# EAGLE schematic 4high (EAGLE 6.6.0)
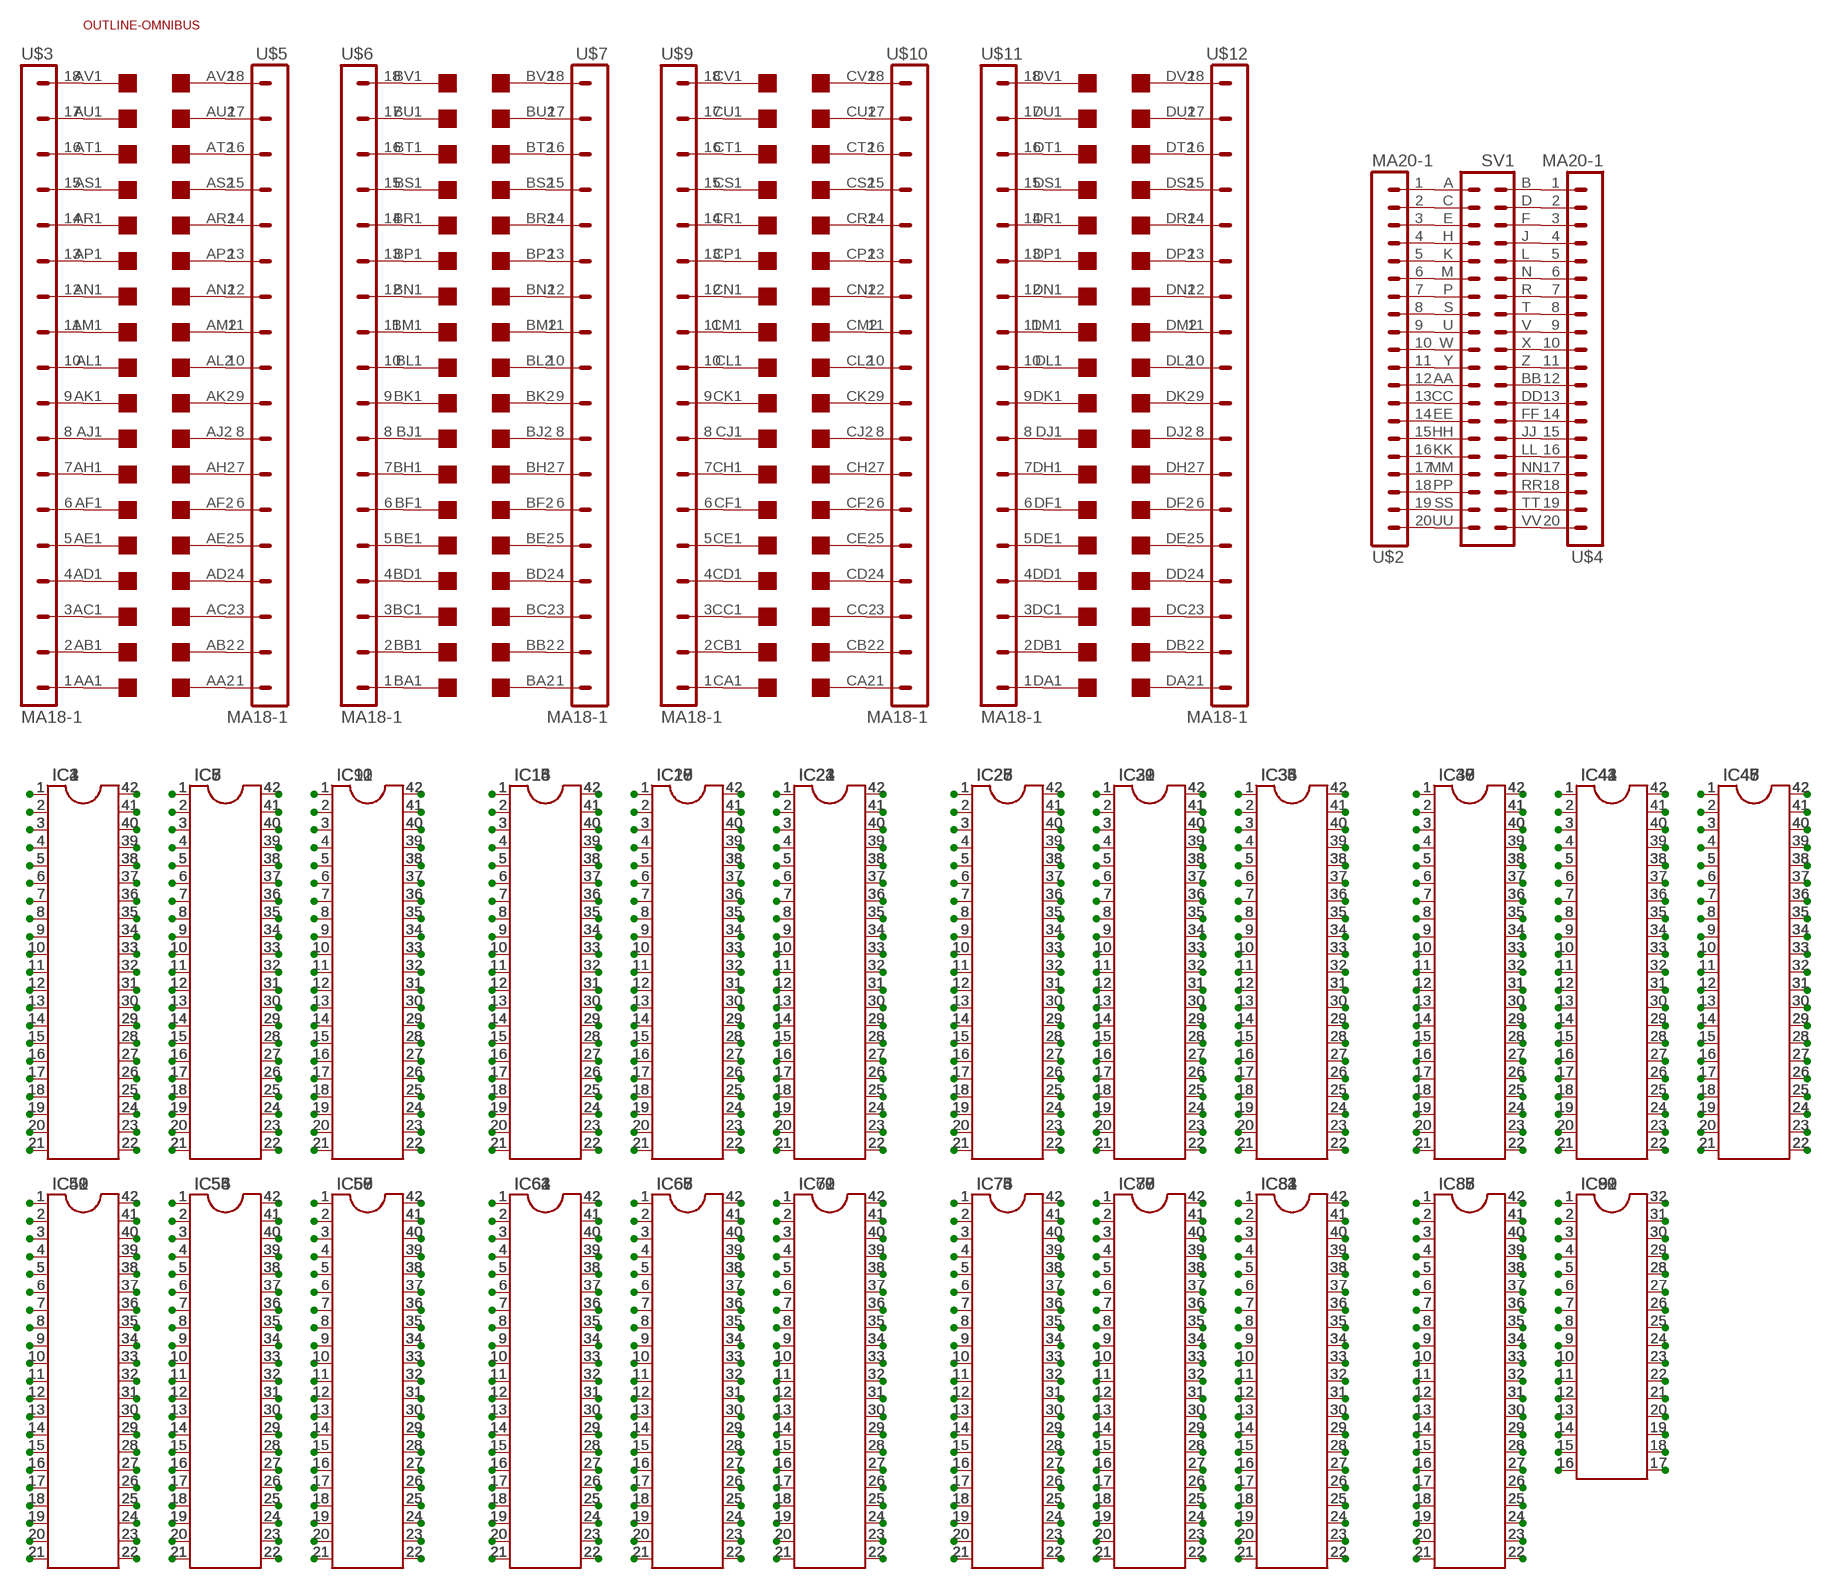
[diagram p0: schematic, sheet 1]

## Parts
IC1  DIL42  [DIL42]
IC2  DIL42  [DIL42]
IC3  DIL42  [DIL42]
IC4  DIL42  [DIL42]
IC5  DIL42  [DIL42]
IC6  DIL42  [DIL42]
IC7  DIL42  [DIL42]
IC8  DIL42  [DIL42]
IC9  DIL42  [DIL42]
IC10  DIL42  [DIL42]
IC11  DIL42  [DIL42]
IC12  DIL42  [DIL42]
IC13  DIL42  [DIL42]
IC14  DIL42  [DIL42]
IC15  DIL42  [DIL42]
IC16  DIL42  [DIL42]
IC17  DIL42  [DIL42]
IC18  DIL42  [DIL42]
IC19  DIL42  [DIL42]
IC20  DIL42  [DIL42]
IC21  DIL42  [DIL42]
IC22  DIL42  [DIL42]
IC23  DIL42  [DIL42]
IC24  DIL42  [DIL42]
IC25  DIL42  [DIL42]
IC26  DIL42  [DIL42]
IC27  DIL42  [DIL42]
IC28  DIL42  [DIL42]
IC29  DIL42  [DIL42]
IC30  DIL42  [DIL42]
IC31  DIL42  [DIL42]
IC32  DIL42  [DIL42]
IC33  DIL42  [DIL42]
IC34  DIL42  [DIL42]
IC35  DIL42  [DIL42]
IC36  DIL42  [DIL42]
IC37  DIL42  [DIL42]
IC38  DIL42  [DIL42]
IC39  DIL42  [DIL42]
IC40  DIL42  [DIL42]
IC41  DIL42  [DIL42]
IC42  DIL42  [DIL42]
IC43  DIL42  [DIL42]
IC44  DIL42  [DIL42]
IC45  DIL42  [DIL42]
IC46  DIL42  [DIL42]
IC47  DIL42  [DIL42]
IC48  DIL42  [DIL42]
IC49  DIL42  [DIL42]
IC50  DIL42  [DIL42]
IC51  DIL42  [DIL42]
IC52  DIL42  [DIL42]
IC53  DIL42  [DIL42]
IC54  DIL42  [DIL42]
IC55  DIL42  [DIL42]
IC56  DIL42  [DIL42]
IC57  DIL42  [DIL42]
IC58  DIL42  [DIL42]
IC59  DIL42  [DIL42]
IC60  DIL42  [DIL42]
IC61  DIL42  [DIL42]
IC62  DIL42  [DIL42]
IC63  DIL42  [DIL42]
IC64  DIL42  [DIL42]
IC65  DIL42  [DIL42]
IC66  DIL42  [DIL42]
IC67  DIL42  [DIL42]
IC68  DIL42  [DIL42]
IC69  DIL42  [DIL42]
IC70  DIL42  [DIL42]
IC71  DIL42  [DIL42]
IC72  DIL42  [DIL42]
IC73  DIL42  [DIL42]
IC74  DIL42  [DIL42]
IC75  DIL42  [DIL42]
IC76  DIL42  [DIL42]
IC77  DIL42  [DIL42]
IC78  DIL42  [DIL42]
IC79  DIL42  [DIL42]
IC80  DIL42  [DIL42]
IC81  DIL42  [DIL42]
IC82  DIL42  [DIL42]
IC83  DIL42  [DIL42]
IC84  DIL42  [DIL42]
IC85  DIL42  [DIL42]
IC86  DIL42  [DIL42]
IC87  DIL42  [DIL42]
IC88  DIL42  [DIL42]
IC89  DIL32  [DIL32]
IC90  DIL32  [DIL32]
IC91  DIL32  [DIL32]
IC92  DIL32  [DIL32]
SV1  DEC40PINH  [DEC40PINH]
U$1  QUAD  [EDGE-CON8]
U$2  MA20-1  [MA20-1]
U$3  MA18-1  [MA18-1]
U$4  MA20-1  [MA20-1]
U$5  MA18-1  [MA18-1]
U$6  MA18-1  [MA18-1]
U$7  MA18-1  [MA18-1]
U$8  OUTLINE-OMNIBUS  [OMNIBUS]
U$9  MA18-1  [MA18-1]
U$10  MA18-1  [MA18-1]
U$11  MA18-1  [MA18-1]
U$12  MA18-1  [MA18-1]

## Nets
GND [supply]: U$1.AC2 U$5.3
N$1: IC1.1 IC2.1 IC3.1 IC4.1
N$2: IC1.2 IC2.2 IC3.2 IC4.2
N$3: IC1.3 IC2.3 IC3.3 IC4.3
N$4: IC1.4 IC2.4 IC3.4 IC4.4
N$5: IC1.5 IC2.5 IC3.5 IC4.5
N$6: IC1.6 IC2.6 IC3.6 IC4.6
N$7: IC1.7 IC2.7 IC3.7 IC4.7
N$8: IC1.8 IC2.8 IC3.8 IC4.8
N$9: IC1.9 IC2.9 IC3.9 IC4.9
N$10: IC1.10 IC2.10 IC3.10 IC4.10
N$11: IC1.11 IC2.11 IC3.11 IC4.11
N$12: IC1.12 IC2.12 IC3.12 IC4.12
N$13: IC1.13 IC2.13 IC3.13 IC4.13
N$14: IC1.14 IC2.14 IC3.14 IC4.14
N$15: IC1.15 IC2.15 IC3.15 IC4.15
N$16: IC1.16 IC2.16 IC3.16 IC4.16
N$17: IC1.17 IC2.17 IC3.17 IC4.17
N$18: IC1.18 IC2.18 IC3.18 IC4.18
N$19: IC1.19 IC2.19 IC3.19 IC4.19
N$20: IC1.20 IC2.20 IC3.20 IC4.20
N$21: IC1.21 IC2.21 IC3.21 IC4.21
N$22: IC1.22 IC2.22 IC3.22 IC4.22
N$23: IC1.23 IC2.23 IC3.23 IC4.23
N$24: IC1.24 IC2.24 IC3.24 IC4.24
N$25: IC1.25 IC2.25 IC3.25 IC4.25
N$26: IC1.26 IC2.26 IC3.26 IC4.26
N$27: IC1.27 IC2.27 IC3.27 IC4.27
N$28: IC1.28 IC2.28 IC3.28 IC4.28
N$29: IC1.29 IC2.29 IC3.29 IC4.29
N$30: IC1.30 IC2.30 IC3.30 IC4.30
N$31: IC1.31 IC2.31 IC3.31 IC4.31
N$32: IC1.32 IC2.32 IC3.32 IC4.32
N$33: IC1.33 IC2.33 IC3.33 IC4.33
N$34: IC1.34 IC2.34 IC3.34 IC4.34
N$35: IC1.35 IC2.35 IC3.35 IC4.35
N$36: IC1.36 IC2.36 IC3.36 IC4.36
N$37: IC1.37 IC2.37 IC3.37 IC4.37
N$38: IC1.38 IC2.38 IC3.38 IC4.38
N$39: IC1.39 IC2.39 IC3.39 IC4.39
N$40: IC1.40 IC2.40 IC3.40 IC4.40
N$41: IC1.41 IC2.41 IC3.41 IC4.41
N$42: IC1.42 IC2.42 IC3.42 IC4.42
N$43: IC5.1 IC6.1 IC7.1 IC8.1
N$44: IC5.2 IC6.2 IC7.2 IC8.2
N$45: IC5.3 IC6.3 IC7.3 IC8.3
N$46: IC5.4 IC6.4 IC7.4 IC8.4
N$47: IC5.5 IC6.5 IC7.5 IC8.5
N$48: IC5.6 IC6.6 IC7.6 IC8.6
N$49: IC5.7 IC6.7 IC7.7 IC8.7
N$50: IC5.8 IC6.8 IC7.8 IC8.8
N$51: IC5.9 IC6.9 IC7.9 IC8.9
N$52: IC5.10 IC6.10 IC7.10 IC8.10
N$53: IC5.11 IC6.11 IC7.11 IC8.11
N$54: IC5.12 IC6.12 IC7.12 IC8.12
N$55: IC5.13 IC6.13 IC7.13 IC8.13
N$56: IC5.14 IC6.14 IC7.14 IC8.14
N$57: IC5.15 IC6.15 IC7.15 IC8.15
N$58: IC5.16 IC6.16 IC7.16 IC8.16
N$59: IC5.17 IC6.17 IC7.17 IC8.17
N$60: IC5.18 IC6.18 IC7.18 IC8.18
N$61: IC5.19 IC6.19 IC7.19 IC8.19
N$62: IC5.20 IC6.20 IC7.20 IC8.20
N$63: IC5.21 IC6.21 IC7.21 IC8.21
N$64: IC5.22 IC6.22 IC7.22 IC8.22
N$65: IC5.23 IC6.23 IC7.23 IC8.23
N$66: IC5.24 IC6.24 IC7.24 IC8.24
N$67: IC5.25 IC6.25 IC7.25 IC8.25
N$68: IC5.26 IC6.26 IC7.26 IC8.26
N$69: IC5.27 IC6.27 IC7.27 IC8.27
N$70: IC5.28 IC6.28 IC7.28 IC8.28
N$71: IC5.29 IC6.29 IC7.29 IC8.29
N$72: IC5.30 IC6.30 IC7.30 IC8.30
N$73: IC5.31 IC6.31 IC7.31 IC8.31
N$74: IC5.32 IC6.32 IC7.32 IC8.32
N$75: IC5.33 IC6.33 IC7.33 IC8.33
N$76: IC5.34 IC6.34 IC7.34 IC8.34
N$77: IC5.35 IC6.35 IC7.35 IC8.35
N$78: IC5.36 IC6.36 IC7.36 IC8.36
N$79: IC5.37 IC6.37 IC7.37 IC8.37
N$80: IC5.38 IC6.38 IC7.38 IC8.38
N$81: IC5.39 IC6.39 IC7.39 IC8.39
N$82: IC5.40 IC6.40 IC7.40 IC8.40
N$83: IC5.41 IC6.41 IC7.41 IC8.41
N$84: IC5.42 IC6.42 IC7.42 IC8.42
N$85: IC9.1 IC10.1 IC11.1 IC12.1
N$86: IC9.2 IC10.2 IC11.2 IC12.2
N$87: IC9.3 IC10.3 IC11.3 IC12.3
N$88: IC9.4 IC10.4 IC11.4 IC12.4
N$89: IC9.5 IC10.5 IC11.5 IC12.5
N$90: IC9.6 IC10.6 IC11.6 IC12.6
N$91: IC9.7 IC10.7 IC11.7 IC12.7
N$92: IC9.8 IC10.8 IC11.8 IC12.8
N$93: IC9.9 IC10.9 IC11.9 IC12.9
N$94: IC9.10 IC10.10 IC11.10 IC12.10
N$95: IC9.11 IC10.11 IC11.11 IC12.11
N$96: IC9.12 IC10.12 IC11.12 IC12.12
N$97: IC9.13 IC10.13 IC11.13 IC12.13
N$98: IC9.14 IC10.14 IC11.14 IC12.14
N$99: IC9.15 IC10.15 IC11.15 IC12.15
N$100: IC9.16 IC10.16 IC11.16 IC12.16
N$101: IC9.17 IC10.17 IC11.17 IC12.17
N$102: IC9.18 IC10.18 IC11.18 IC12.18
N$103: IC9.19 IC10.19 IC11.19 IC12.19
N$104: IC9.20 IC10.20 IC11.20 IC12.20
N$105: IC9.21 IC10.21 IC11.21 IC12.21
N$106: IC9.22 IC10.22 IC11.22 IC12.22
N$107: IC9.23 IC10.23 IC11.23 IC12.23
N$108: IC9.24 IC10.24 IC11.24 IC12.24
N$109: IC9.25 IC10.25 IC11.25 IC12.25
N$110: IC9.26 IC10.26 IC11.26 IC12.26
N$111: IC9.27 IC10.27 IC11.27 IC12.27
N$112: IC9.28 IC10.28 IC11.28 IC12.28
N$113: IC9.29 IC10.29 IC11.29 IC12.29
N$114: IC9.30 IC10.30 IC11.30 IC12.30
N$115: IC9.31 IC10.31 IC11.31 IC12.31
N$116: IC9.32 IC10.32 IC11.32 IC12.32
N$117: IC9.33 IC10.33 IC11.33 IC12.33
N$118: IC9.34 IC10.34 IC11.34 IC12.34
N$119: IC9.35 IC10.35 IC11.35 IC12.35
N$120: IC9.36 IC10.36 IC11.36 IC12.36
N$121: IC9.37 IC10.37 IC11.37 IC12.37
N$122: IC9.38 IC10.38 IC11.38 IC12.38
N$123: IC9.39 IC10.39 IC11.39 IC12.39
N$124: IC9.40 IC10.40 IC11.40 IC12.40
N$125: IC9.41 IC10.41 IC11.41 IC12.41
N$126: IC9.42 IC10.42 IC11.42 IC12.42
N$127: IC13.1 IC14.1 IC15.1 IC16.1
N$128: IC13.2 IC14.2 IC15.2 IC16.2
N$129: IC13.3 IC14.3 IC15.3 IC16.3
N$130: IC13.4 IC14.4 IC15.4 IC16.4
N$131: IC13.5 IC14.5 IC15.5 IC16.5
N$132: IC13.6 IC14.6 IC15.6 IC16.6
N$133: IC13.7 IC14.7 IC15.7 IC16.7
N$134: IC13.8 IC14.8 IC15.8 IC16.8
N$135: IC13.9 IC14.9 IC15.9 IC16.9
N$136: IC13.10 IC14.10 IC15.10 IC16.10
N$137: IC13.11 IC14.11 IC15.11 IC16.11
N$138: IC13.12 IC14.12 IC15.12 IC16.12
N$139: IC13.13 IC14.13 IC15.13 IC16.13
N$140: IC13.14 IC14.14 IC15.14 IC16.14
N$141: IC13.15 IC14.15 IC15.15 IC16.15
N$142: IC13.16 IC14.16 IC15.16 IC16.16
N$143: IC13.17 IC14.17 IC15.17 IC16.17
N$144: IC13.18 IC14.18 IC15.18 IC16.18
N$145: IC13.19 IC14.19 IC15.19 IC16.19
N$146: IC13.20 IC14.20 IC15.20 IC16.20
N$147: IC13.21 IC14.21 IC15.21 IC16.21
N$148: IC13.22 IC14.22 IC15.22 IC16.22
N$149: IC13.23 IC14.23 IC15.23 IC16.23
N$150: IC13.24 IC14.24 IC15.24 IC16.24
N$151: IC13.25 IC14.25 IC15.25 IC16.25
N$152: IC13.26 IC14.26 IC15.26 IC16.26
N$153: IC13.27 IC14.27 IC15.27 IC16.27
N$154: IC13.28 IC14.28 IC15.28 IC16.28
N$155: IC13.29 IC14.29 IC15.29 IC16.29
N$156: IC13.30 IC14.30 IC15.30 IC16.30
N$157: IC13.31 IC14.31 IC15.31 IC16.31
N$158: IC13.32 IC14.32 IC15.32 IC16.32
N$159: IC13.33 IC14.33 IC15.33 IC16.33
N$160: IC13.34 IC14.34 IC15.34 IC16.34
N$161: IC13.35 IC14.35 IC15.35 IC16.35
N$162: IC13.36 IC14.36 IC15.36 IC16.36
N$163: IC13.37 IC14.37 IC15.37 IC16.37
N$164: IC13.38 IC14.38 IC15.38 IC16.38
N$165: IC13.39 IC14.39 IC15.39 IC16.39
N$166: IC13.40 IC14.40 IC15.40 IC16.40
N$167: IC13.41 IC14.41 IC15.41 IC16.41
N$168: IC13.42 IC14.42 IC15.42 IC16.42
N$169: U$1.AK1 U$3.9
N$170: U$1.AL1 U$3.10
N$171: U$1.AM1 U$3.11
N$172: U$1.AN1 U$3.12
N$173: U$1.AP1 U$3.13
N$174: U$1.AR1 U$3.14
N$175: U$1.AS1 U$3.15
N$176: U$1.AT1 U$3.16
N$177: U$1.AU1 U$3.17
N$178: U$1.AV1 U$3.18
N$179: U$1.AJ1 U$3.8
N$180: U$1.AH1 U$3.7
N$181: U$1.AF1 U$3.6
N$182: U$1.AE1 U$3.5
N$183: U$1.AD1 U$3.4
N$184: U$1.AC1 U$3.3
N$185: U$1.AB1 U$3.2
N$186: U$1.AA1 U$3.1
N$187: U$1.AL2 U$5.10
N$188: U$1.AM2 U$5.11
N$189: U$1.AN2 U$5.12
N$190: U$1.AP2 U$5.13
N$191: U$1.AR2 U$5.14
N$192: U$1.AS2 U$5.15
N$193: U$1.AT2 U$5.16
N$194: U$1.AK2 U$5.9
N$195: U$1.AJ2 U$5.8
N$196: U$1.AH2 U$5.7
N$197: U$1.AF2 U$5.6
N$198: U$1.AE2 U$5.5
N$199: U$1.AD2 U$5.4
N$200: IC17.1 IC18.1 IC19.1 IC20.1
N$201: U$1.AU2 U$5.17
N$202: U$1.AV2 U$5.18
N$203: U$1.AB2 U$5.2
N$204: IC17.2 IC18.2 IC19.2 IC20.2
N$205: IC17.3 IC18.3 IC19.3 IC20.3
N$206: IC17.4 IC18.4 IC19.4 IC20.4
N$207: IC17.5 IC18.5 IC19.5 IC20.5
N$208: IC17.6 IC18.6 IC19.6 IC20.6
N$209: IC17.7 IC18.7 IC19.7 IC20.7
N$210: IC17.8 IC18.8 IC19.8 IC20.8
N$211: IC17.9 IC18.9 IC19.9 IC20.9
N$212: IC17.10 IC18.10 IC19.10 IC20.10
N$213: IC17.11 IC18.11 IC19.11 IC20.11
N$214: IC17.12 IC18.12 IC19.12 IC20.12
N$215: IC17.13 IC18.13 IC19.13 IC20.13
N$216: IC17.14 IC18.14 IC19.14 IC20.14
N$217: IC17.15 IC18.15 IC19.15 IC20.15
N$218: IC17.16 IC18.16 IC19.16 IC20.16
N$219: IC17.17 IC18.17 IC19.17 IC20.17
N$220: IC17.18 IC18.18 IC19.18 IC20.18
N$221: IC17.19 IC18.19 IC19.19 IC20.19
N$222: IC17.20 IC18.20 IC19.20 IC20.20
N$223: IC17.21 IC18.21 IC19.21 IC20.21
N$224: IC17.22 IC18.22 IC19.22 IC20.22
N$225: IC17.23 IC18.23 IC19.23 IC20.23
N$226: IC17.24 IC18.24 IC19.24 IC20.24
N$227: IC17.25 IC18.25 IC19.25 IC20.25
N$228: IC17.26 IC18.26 IC19.26 IC20.26
N$229: IC17.27 IC18.27 IC19.27 IC20.27
N$230: IC17.28 IC18.28 IC19.28 IC20.28
N$231: IC17.29 IC18.29 IC19.29 IC20.29
N$232: IC17.30 IC18.30 IC19.30 IC20.30
N$233: IC17.31 IC18.31 IC19.31 IC20.31
N$234: IC17.32 IC18.32 IC19.32 IC20.32
N$235: IC17.33 IC18.33 IC19.33 IC20.33
N$236: IC17.34 IC18.34 IC19.34 IC20.34
N$237: IC17.35 IC18.35 IC19.35 IC20.35
N$238: IC17.36 IC18.36 IC19.36 IC20.36
N$239: IC17.37 IC18.37 IC19.37 IC20.37
N$240: IC17.38 IC18.38 IC19.38 IC20.38
N$241: IC17.39 IC18.39 IC19.39 IC20.39
N$242: IC17.40 IC18.40 IC19.40 IC20.40
N$243: IC17.41 IC18.41 IC19.41 IC20.41
N$244: IC17.42 IC18.42 IC19.42 IC20.42
N$245: IC21.1 IC22.1 IC23.1 IC24.1
N$246: IC21.2 IC22.2 IC23.2 IC24.2
N$247: IC21.3 IC22.3 IC23.3 IC24.3
N$248: IC21.4 IC22.4 IC23.4 IC24.4
N$249: IC21.5 IC22.5 IC23.5 IC24.5
N$250: IC21.6 IC22.6 IC23.6 IC24.6
N$251: IC21.7 IC22.7 IC23.7 IC24.7
N$252: IC21.8 IC22.8 IC23.8 IC24.8
N$253: IC21.9 IC22.9 IC23.9 IC24.9
N$254: IC21.10 IC22.10 IC23.10 IC24.10
N$255: IC21.11 IC22.11 IC23.11 IC24.11
N$256: IC21.12 IC22.12 IC23.12 IC24.12
N$257: IC21.13 IC22.13 IC23.13 IC24.13
N$258: IC21.14 IC22.14 IC23.14 IC24.14
N$259: IC21.15 IC22.15 IC23.15 IC24.15
N$260: IC21.16 IC22.16 IC23.16 IC24.16
N$261: IC21.17 IC22.17 IC23.17 IC24.17
N$262: IC21.18 IC22.18 IC23.18 IC24.18
N$263: IC21.19 IC22.19 IC23.19 IC24.19
N$264: IC21.20 IC22.20 IC23.20 IC24.20
N$265: IC21.21 IC22.21 IC23.21 IC24.21
N$266: IC21.22 IC22.22 IC23.22 IC24.22
N$267: IC21.23 IC22.23 IC23.23 IC24.23
N$268: IC21.24 IC22.24 IC23.24 IC24.24
N$269: IC21.25 IC22.25 IC23.25 IC24.25
N$270: IC21.26 IC22.26 IC23.26 IC24.26
N$271: IC21.27 IC22.27 IC23.27 IC24.27
N$272: IC21.28 IC22.28 IC23.28 IC24.28
N$273: IC21.29 IC22.29 IC23.29 IC24.29
N$274: IC21.30 IC22.30 IC23.30 IC24.30
N$275: IC21.31 IC22.31 IC23.31 IC24.31
N$276: IC21.32 IC22.32 IC23.32 IC24.32
N$277: IC21.33 IC22.33 IC23.33 IC24.33
N$278: IC21.34 IC22.34 IC23.34 IC24.34
N$279: IC21.35 IC22.35 IC23.35 IC24.35
N$280: IC21.36 IC22.36 IC23.36 IC24.36
N$281: IC21.37 IC22.37 IC23.37 IC24.37
N$282: IC21.38 IC22.38 IC23.38 IC24.38
N$283: IC21.39 IC22.39 IC23.39 IC24.39
N$284: IC21.40 IC22.40 IC23.40 IC24.40
N$285: IC21.41 IC22.41 IC23.41 IC24.41
N$286: IC21.42 IC22.42 IC23.42 IC24.42
N$287: IC25.1 IC26.1 IC27.1 IC28.1
N$288: IC25.2 IC26.2 IC27.2 IC28.2
N$289: IC25.3 IC26.3 IC27.3 IC28.3
N$290: IC25.4 IC26.4 IC27.4 IC28.4
N$291: IC25.5 IC26.5 IC27.5 IC28.5
N$292: IC25.6 IC26.6 IC27.6 IC28.6
N$293: IC25.7 IC26.7 IC27.7 IC28.7
N$294: IC25.8 IC26.8 IC27.8 IC28.8
N$295: IC25.9 IC26.9 IC27.9 IC28.9
N$296: IC25.10 IC26.10 IC27.10 IC28.10
N$297: IC25.11 IC26.11 IC27.11 IC28.11
N$298: IC25.12 IC26.12 IC27.12 IC28.12
N$299: IC25.13 IC26.13 IC27.13 IC28.13
N$300: IC25.14 IC26.14 IC27.14 IC28.14
N$301: IC25.15 IC26.15 IC27.15 IC28.15
N$302: IC25.16 IC26.16 IC27.16 IC28.16
N$303: IC25.17 IC26.17 IC27.17 IC28.17
N$304: IC25.18 IC26.18 IC27.18 IC28.18
N$305: IC25.19 IC26.19 IC27.19 IC28.19
N$306: IC25.20 IC26.20 IC27.20 IC28.20
N$307: IC25.21 IC26.21 IC27.21 IC28.21
N$308: IC25.22 IC26.22 IC27.22 IC28.22
N$309: IC25.23 IC26.23 IC27.23 IC28.23
N$310: IC25.24 IC26.24 IC27.24 IC28.24
N$311: IC25.25 IC26.25 IC27.25 IC28.25
N$312: IC25.26 IC26.26 IC27.26 IC28.26
N$313: IC25.27 IC26.27 IC27.27 IC28.27
N$314: IC25.28 IC26.28 IC27.28 IC28.28
N$315: IC25.29 IC26.29 IC27.29 IC28.29
N$316: IC25.30 IC26.30 IC27.30 IC28.30
N$317: IC25.31 IC26.31 IC27.31 IC28.31
N$318: IC25.32 IC26.32 IC27.32 IC28.32
N$319: IC25.33 IC26.33 IC27.33 IC28.33
N$320: IC25.34 IC26.34 IC27.34 IC28.34
N$321: IC25.35 IC26.35 IC27.35 IC28.35
N$322: IC25.36 IC26.36 IC27.36 IC28.36
N$323: IC25.37 IC26.37 IC27.37 IC28.37
N$324: IC25.38 IC26.38 IC27.38 IC28.38
N$325: IC25.39 IC26.39 IC27.39 IC28.39
N$326: IC25.40 IC26.40 IC27.40 IC28.40
N$327: IC25.41 IC26.41 IC27.41 IC28.41
N$328: IC25.42 IC26.42 IC27.42 IC28.42
N$329: IC29.1 IC30.1 IC31.1 IC32.1
N$330: IC29.2 IC30.2 IC31.2 IC32.2
N$331: IC29.3 IC30.3 IC31.3 IC32.3
N$332: IC29.4 IC30.4 IC31.4 IC32.4
N$333: IC29.5 IC30.5 IC31.5 IC32.5
N$334: IC29.6 IC30.6 IC31.6 IC32.6
N$335: IC29.7 IC30.7 IC31.7 IC32.7
N$336: IC29.8 IC30.8 IC31.8 IC32.8
N$337: IC29.9 IC30.9 IC31.9 IC32.9
N$338: IC29.10 IC30.10 IC31.10 IC32.10
N$339: IC29.11 IC30.11 IC31.11 IC32.11
N$340: IC29.12 IC30.12 IC31.12 IC32.12
N$341: IC29.13 IC30.13 IC31.13 IC32.13
N$342: IC29.14 IC30.14 IC31.14 IC32.14
N$343: IC29.15 IC30.15 IC31.15 IC32.15
N$344: IC29.16 IC30.16 IC31.16 IC32.16
N$345: IC29.17 IC30.17 IC31.17 IC32.17
N$346: IC29.18 IC30.18 IC31.18 IC32.18
N$347: IC29.19 IC30.19 IC31.19 IC32.19
N$348: IC29.20 IC30.20 IC31.20 IC32.20
N$349: IC29.21 IC30.21 IC31.21 IC32.21
N$350: IC29.22 IC30.22 IC31.22 IC32.22
N$351: IC29.23 IC30.23 IC31.23 IC32.23
N$352: IC29.24 IC30.24 IC31.24 IC32.24
N$353: IC29.25 IC30.25 IC31.25 IC32.25
N$354: IC29.26 IC30.26 IC31.26 IC32.26
N$355: IC29.27 IC30.27 IC31.27 IC32.27
N$356: IC29.28 IC30.28 IC31.28 IC32.28
N$357: IC29.29 IC30.29 IC31.29 IC32.29
N$358: IC29.30 IC30.30 IC31.30 IC32.30
N$359: IC29.31 IC30.31 IC31.31 IC32.31
N$360: IC29.32 IC30.32 IC31.32 IC32.32
N$361: IC29.33 IC30.33 IC31.33 IC32.33
N$362: IC29.34 IC30.34 IC31.34 IC32.34
N$363: IC29.35 IC30.35 IC31.35 IC32.35
N$364: IC29.36 IC30.36 IC31.36 IC32.36
N$365: IC29.37 IC30.37 IC31.37 IC32.37
N$366: IC29.38 IC30.38 IC31.38 IC32.38
N$367: IC29.39 IC30.39 IC31.39 IC32.39
N$368: IC29.40 IC30.40 IC31.40 IC32.40
N$369: IC29.41 IC30.41 IC31.41 IC32.41
N$370: IC29.42 IC30.42 IC31.42 IC32.42
N$371: IC33.1 IC34.1 IC35.1 IC36.1
N$372: IC33.2 IC34.2 IC35.2 IC36.2
N$373: U$1.BV1 U$6.18
N$374: U$1.BU1 U$6.17
N$375: U$1.BT1 U$6.16
N$376: U$1.BS1 U$6.15
N$377: U$1.BR1 U$6.14
N$378: U$1.BP1 U$6.13
N$379: U$1.BN1 U$6.12
N$380: U$1.BM1 U$6.11
N$381: U$1.BL1 U$6.10
N$382: U$1.BK1 U$6.9
N$383: U$1.BJ1 U$6.8
N$384: U$1.BH1 U$6.7
N$385: U$1.BF1 U$6.6
N$386: U$1.BE1 U$6.5
N$387: U$1.BD1 U$6.4
N$388: U$1.BC1 U$6.3
N$389: U$1.BB1 U$6.2
N$390: U$1.BA1 U$6.1
N$391: U$1.BV2 U$7.18
N$392: U$1.BU2 U$7.17
N$393: U$1.BT2 U$7.16
N$394: U$1.BS2 U$7.15
N$395: U$1.BR2 U$7.14
N$396: U$1.BP2 U$7.13
N$397: U$1.BN2 U$7.12
N$398: U$1.BM2 U$7.11
N$399: U$1.BL2 U$7.10
N$400: U$1.BK2 U$7.9
N$401: U$1.BJ2 U$7.8
N$402: U$1.BH2 U$7.7
N$403: U$1.BF2 U$7.6
N$404: U$1.BE2 U$7.5
N$405: U$1.BD2 U$7.4
N$406: U$1.BC2 U$7.3
N$407: U$1.BB2 U$7.2
N$408: U$1.BA2 U$7.1
N$409: U$1.CV1 U$9.18
N$410: U$1.CU1 U$9.17
N$411: U$1.CT1 U$9.16
N$412: U$1.CS1 U$9.15
N$413: U$1.CR1 U$9.14
N$414: U$1.CP1 U$9.13
N$415: U$1.CN1 U$9.12
N$416: U$1.CM1 U$9.11
N$417: U$1.CL1 U$9.10
N$418: U$1.CK1 U$9.9
N$419: U$1.CJ1 U$9.8
N$420: U$1.CH1 U$9.7
N$421: U$1.CF1 U$9.6
N$422: U$1.CE1 U$9.5
N$423: U$1.CD1 U$9.4
N$424: U$1.CC1 U$9.3
N$425: U$1.CB1 U$9.2
N$426: U$1.CA1 U$9.1
N$427: U$1.CV2 U$10.18
N$428: U$1.CU2 U$10.17
N$429: U$1.CT2 U$10.16
N$430: U$1.CS2 U$10.15
N$431: U$1.CR2 U$10.14
N$432: U$1.CP2 U$10.13
N$433: U$1.CN2 U$10.12
N$434: U$1.CM2 U$10.11
N$435: U$1.CL2 U$10.10
N$436: U$1.CK2 U$10.9
N$437: U$1.CJ2 U$10.8
N$438: U$1.CH2 U$10.7
N$439: U$1.CF2 U$10.6
N$440: U$1.CE2 U$10.5
N$441: U$1.CD2 U$10.4
N$442: U$1.CC2 U$10.3
N$443: U$1.CB2 U$10.2
N$444: U$1.CA2 U$10.1
N$445: U$1.DV1 U$11.18
N$446: U$1.DU1 U$11.17
N$447: U$1.DT1 U$11.16
N$448: U$1.DS1 U$11.15
N$449: U$1.DR1 U$11.14
N$450: U$1.DP1 U$11.13
N$451: U$1.DN1 U$11.12
N$452: U$1.DM1 U$11.11
N$453: U$1.DL1 U$11.10
N$454: U$1.DK1 U$11.9
N$455: U$1.DJ1 U$11.8
N$456: U$1.DH1 U$11.7
N$457: U$1.DF1 U$11.6
N$458: U$1.DE1 U$11.5
N$459: U$1.DD1 U$11.4
N$460: U$1.DC1 U$11.3
N$461: U$1.DB1 U$11.2
N$462: U$1.DA1 U$11.1
N$463: U$1.DV2 U$12.18
N$464: U$1.DU2 U$12.17
N$465: U$1.DT2 U$12.16
N$466: U$1.DS2 U$12.15
N$467: U$1.DR2 U$12.14
N$468: U$1.DP2 U$12.13
N$469: U$1.DN2 U$12.12
N$470: U$1.DM2 U$12.11
N$471: U$1.DL2 U$12.10
N$472: U$1.DK2 U$12.9
N$473: U$1.DJ2 U$12.8
N$474: U$1.DH2 U$12.7
N$475: U$1.DF2 U$12.6
N$476: U$1.DE2 U$12.5
N$477: U$1.DD2 U$12.4
N$478: U$1.DC2 U$12.3
N$479: U$1.DB2 U$12.2
N$480: U$1.DA2 U$12.1
N$481: IC33.3 IC34.3 IC35.3 IC36.3
N$482: IC33.4 IC34.4 IC35.4 IC36.4
N$483: IC33.5 IC34.5 IC35.5 IC36.5
N$484: IC33.6 IC34.6 IC35.6 IC36.6
N$485: IC33.7 IC34.7 IC35.7 IC36.7
N$486: IC33.8 IC34.8 IC35.8 IC36.8
N$487: IC33.9 IC34.9 IC35.9 IC36.9
N$488: IC33.10 IC34.10 IC35.10 IC36.10
N$489: IC33.11 IC34.11 IC35.11 IC36.11
N$490: IC33.12 IC34.12 IC35.12 IC36.12
N$491: IC33.13 IC34.13 IC35.13 IC36.13
N$492: IC33.14 IC34.14 IC35.14 IC36.14
N$493: IC33.15 IC34.15 IC35.15 IC36.15
N$494: IC33.16 IC34.16 IC35.16 IC36.16
N$495: IC33.17 IC34.17 IC35.17 IC36.17
N$496: IC33.18 IC34.18 IC35.18 IC36.18
N$497: IC33.19 IC34.19 IC35.19 IC36.19
N$498: IC33.20 IC34.20 IC35.20 IC36.20
N$499: IC33.21 IC34.21 IC35.21 IC36.21
N$500: IC33.22 IC34.22 IC35.22 IC36.22
N$501: IC33.23 IC34.23 IC35.23 IC36.23
N$502: IC33.24 IC34.24 IC35.24 IC36.24
N$503: IC33.25 IC34.25 IC35.25 IC36.25
N$504: IC33.26 IC34.26 IC35.26 IC36.26
N$505: IC33.27 IC34.27 IC35.27 IC36.27
N$506: IC33.28 IC34.28 IC35.28 IC36.28
N$507: IC33.29 IC34.29 IC35.29 IC36.29
N$508: IC33.30 IC34.30 IC35.30 IC36.30
N$509: IC33.31 IC34.31 IC35.31 IC36.31
N$510: IC33.32 IC34.32 IC35.32 IC36.32
N$511: IC33.33 IC34.33 IC35.33 IC36.33
N$512: IC33.34 IC34.34 IC35.34 IC36.34
N$513: IC33.35 IC34.35 IC35.35 IC36.35
N$514: IC33.36 IC34.36 IC35.36 IC36.36
N$515: IC33.37 IC34.37 IC35.37 IC36.37
N$516: IC33.38 IC34.38 IC35.38 IC36.38
N$517: IC33.39 IC34.39 IC35.39 IC36.39
N$518: IC33.40 IC34.40 IC35.40 IC36.40
N$519: IC33.41 IC34.41 IC35.41 IC36.41
N$520: IC33.42 IC34.42 IC35.42 IC36.42
N$521: IC37.1 IC38.1 IC39.1 IC40.1
N$522: IC37.2 IC38.2 IC39.2 IC40.2
N$523: IC37.3 IC38.3 IC39.3 IC40.3
N$524: IC37.4 IC38.4 IC39.4 IC40.4
N$525: IC37.5 IC38.5 IC39.5 IC40.5
N$526: IC37.6 IC38.6 IC39.6 IC40.6
N$527: IC37.7 IC38.7 IC39.7 IC40.7
N$528: IC37.8 IC38.8 IC39.8 IC40.8
N$529: IC37.9 IC38.9 IC39.9 IC40.9
N$530: IC37.10 IC38.10 IC39.10 IC40.10
N$531: IC37.11 IC38.11 IC39.11 IC40.11
N$532: IC37.12 IC38.12 IC39.12 IC40.12
N$533: IC37.13 IC38.13 IC39.13 IC40.13
N$534: IC37.14 IC38.14 IC39.14 IC40.14
N$535: IC37.15 IC38.15 IC39.15 IC40.15
N$536: IC37.16 IC38.16 IC39.16 IC40.16
N$537: IC37.17 IC38.17 IC39.17 IC40.17
N$538: IC37.18 IC38.18 IC39.18 IC40.18
N$539: IC37.19 IC38.19 IC39.19 IC40.19
N$540: IC37.20 IC38.20 IC39.20 IC40.20
N$541: IC37.21 IC38.21 IC39.21 IC40.21
N$542: IC37.22 IC38.22 IC39.22 IC40.22
N$543: IC37.23 IC38.23 IC39.23 IC40.23
N$544: IC37.24 IC38.24 IC39.24 IC40.24
N$545: IC37.25 IC38.25 IC39.25 IC40.25
N$546: IC37.26 IC38.26 IC39.26 IC40.26
N$547: IC37.27 IC38.27 IC39.27 IC40.27
N$548: IC37.28 IC38.28 IC39.28 IC40.28
N$549: IC37.29 IC38.29 IC39.29 IC40.29
N$550: IC37.30 IC38.30 IC39.30 IC40.30
N$551: IC37.31 IC38.31 IC39.31 IC40.31
N$552: IC37.32 IC38.32 IC39.32 IC40.32
N$553: IC37.33 IC38.33 IC39.33 IC40.33
N$554: IC37.34 IC38.34 IC39.34 IC40.34
N$555: IC37.35 IC38.35 IC39.35 IC40.35
N$556: IC37.36 IC38.36 IC39.36 IC40.36
N$557: IC37.37 IC38.37 IC39.37 IC40.37
N$558: IC37.38 IC38.38 IC39.38 IC40.38
N$559: IC37.39 IC38.39 IC39.39 IC40.39
N$560: IC37.40 IC38.40 IC39.40 IC40.40
N$561: IC37.41 IC38.41 IC39.41 IC40.41
N$562: IC37.42 IC38.42 IC39.42 IC40.42
N$563: IC41.1 IC42.1 IC43.1 IC44.1
N$564: IC41.2 IC42.2 IC43.2 IC44.2
N$565: IC41.3 IC42.3 IC43.3 IC44.3
N$566: IC41.4 IC42.4 IC43.4 IC44.4
N$567: IC41.5 IC42.5 IC43.5 IC44.5
N$568: IC41.6 IC42.6 IC43.6 IC44.6
N$569: IC41.7 IC42.7 IC43.7 IC44.7
N$570: IC41.8 IC42.8 IC43.8 IC44.8
N$571: IC41.9 IC42.9 IC43.9 IC44.9
N$572: IC41.10 IC42.10 IC43.10 IC44.10
N$573: IC41.11 IC42.11 IC43.11 IC44.11
N$574: IC41.12 IC42.12 IC43.12 IC44.12
N$575: IC41.13 IC42.13 IC43.13 IC44.13
N$576: IC41.14 IC42.14 IC43.14 IC44.14
N$577: IC41.15 IC42.15 IC43.15 IC44.15
N$578: IC41.16 IC42.16 IC43.16 IC44.16
N$579: IC41.17 IC42.17 IC43.17 IC44.17
N$580: IC41.18 IC42.18 IC43.18 IC44.18
N$581: IC41.19 IC42.19 IC43.19 IC44.19
N$582: IC41.20 IC42.20 IC43.20 IC44.20
N$583: IC41.21 IC42.21 IC43.21 IC44.21
N$584: IC41.22 IC42.22 IC43.22 IC44.22
N$585: IC41.23 IC42.23 IC43.23 IC44.23
N$586: IC41.24 IC42.24 IC43.24 IC44.24
N$587: IC41.25 IC42.25 IC43.25 IC44.25
N$588: IC41.26 IC42.26 IC43.26 IC44.26
N$589: IC41.27 IC42.27 IC43.27 IC44.27
N$590: IC41.28 IC42.28 IC43.28 IC44.28
N$591: IC41.29 IC42.29 IC43.29 IC44.29
N$592: IC41.30 IC42.30 IC43.30 IC44.30
N$593: IC41.31 IC42.31 IC43.31 IC44.31
N$594: IC41.32 IC42.32 IC43.32 IC44.32
N$595: IC41.33 IC42.33 IC43.33 IC44.33
N$596: IC41.34 IC42.34 IC43.34 IC44.34
N$597: IC41.35 IC42.35 IC43.35 IC44.35
N$598: IC41.36 IC42.36 IC43.36 IC44.36
N$599: IC41.37 IC42.37 IC43.37 IC44.37
N$600: IC41.38 IC42.38 IC43.38 IC44.38
N$601: IC41.39 IC42.39 IC43.39 IC44.39
N$602: IC41.40 IC42.40 IC43.40 IC44.40
N$603: IC41.41 IC42.41 IC43.41 IC44.41
N$604: IC41.42 IC42.42 IC43.42 IC44.42
N$605: IC45.1 IC46.1 IC47.1 IC48.1
N$606: IC45.2 IC46.2 IC47.2 IC48.2
N$607: IC45.3 IC46.3 IC47.3 IC48.3
N$608: IC45.4 IC46.4 IC47.4 IC48.4
N$609: IC45.5 IC46.5 IC47.5 IC48.5
N$610: IC45.6 IC46.6 IC47.6 IC48.6
N$611: IC45.7 IC46.7 IC47.7 IC48.7
N$612: IC45.8 IC46.8 IC47.8 IC48.8
N$613: IC45.9 IC46.9 IC47.9 IC48.9
N$614: IC45.10 IC46.10 IC47.10 IC48.10
N$615: IC45.11 IC46.11 IC47.11 IC48.11
N$616: IC45.12 IC46.12 IC47.12 IC48.12
N$617: IC45.13 IC46.13 IC47.13 IC48.13
N$618: IC45.14 IC46.14 IC47.14 IC48.14
N$619: IC45.15 IC46.15 IC47.15 IC48.15
N$620: IC45.16 IC46.16 IC47.16 IC48.16
N$621: IC45.17 IC46.17 IC47.17 IC48.17
N$622: IC45.18 IC46.18 IC47.18 IC48.18
N$623: IC45.19 IC46.19 IC47.19 IC48.19
N$624: IC45.20 IC46.20 IC47.20 IC48.20
N$625: IC45.21 IC46.21 IC47.21 IC48.21
N$626: IC45.22 IC46.22 IC47.22 IC48.22
N$627: IC45.23 IC46.23 IC47.23 IC48.23
N$628: IC45.24 IC46.24 IC47.24 IC48.24
N$629: IC45.25 IC46.25 IC47.25 IC48.25
N$630: IC45.26 IC46.26 IC47.26 IC48.26
N$631: IC45.27 IC46.27 IC47.27 IC48.27
N$632: IC45.28 IC46.28 IC47.28 IC48.28
N$633: IC45.29 IC46.29 IC47.29 IC48.29
N$634: IC45.30 IC46.30 IC47.30 IC48.30
N$635: IC45.31 IC46.31 IC47.31 IC48.31
N$636: IC45.32 IC46.32 IC47.32 IC48.32
N$637: IC45.33 IC46.33 IC47.33 IC48.33
N$638: IC45.34 IC46.34 IC47.34 IC48.34
N$639: IC45.35 IC46.35 IC47.35 IC48.35
N$640: IC45.36 IC46.36 IC47.36 IC48.36
N$641: IC45.37 IC46.37 IC47.37 IC48.37
N$642: IC45.38 IC46.38 IC47.38 IC48.38
N$643: IC45.39 IC46.39 IC47.39 IC48.39
N$644: IC45.40 IC46.40 IC47.40 IC48.40
N$645: IC45.41 IC46.41 IC47.41 IC48.41
N$646: IC45.42 IC46.42 IC47.42 IC48.42
N$647: IC49.1 IC50.1 IC51.1 IC52.1
N$648: IC49.2 IC50.2 IC51.2 IC52.2
N$649: IC49.3 IC50.3 IC51.3 IC52.3
N$650: IC49.4 IC50.4 IC51.4 IC52.4
N$651: IC49.5 IC50.5 IC51.5 IC52.5
N$652: IC49.6 IC50.6 IC51.6 IC52.6
N$653: IC49.7 IC50.7 IC51.7 IC52.7
N$654: IC49.8 IC50.8 IC51.8 IC52.8
N$655: IC49.9 IC50.9 IC51.9 IC52.9
N$656: IC49.10 IC50.10 IC51.10 IC52.10
N$657: IC49.11 IC50.11 IC51.11 IC52.11
N$658: IC49.12 IC50.12 IC51.12 IC52.12
N$659: IC49.13 IC50.13 IC51.13 IC52.13
N$660: IC49.14 IC50.14 IC51.14 IC52.14
N$661: IC49.15 IC50.15 IC51.15 IC52.15
N$662: IC49.16 IC50.16 IC51.16 IC52.16
N$663: IC49.17 IC50.17 IC51.17 IC52.17
N$664: IC49.18 IC50.18 IC51.18 IC52.18
N$665: IC49.19 IC50.19 IC51.19 IC52.19
N$666: IC49.20 IC50.20 IC51.20 IC52.20
N$667: IC49.21 IC50.21 IC51.21 IC52.21
N$668: IC49.22 IC50.22 IC51.22 IC52.22
N$669: IC49.23 IC50.23 IC51.23 IC52.23
N$670: IC49.24 IC50.24 IC51.24 IC52.24
N$671: IC49.25 IC50.25 IC51.25 IC52.25
N$672: IC49.26 IC50.26 IC51.26 IC52.26
N$673: IC49.27 IC50.27 IC51.27 IC52.27
N$674: IC49.28 IC50.28 IC51.28 IC52.28
N$675: IC49.29 IC50.29 IC51.29 IC52.29
N$676: IC49.30 IC50.30 IC51.30 IC52.30
N$677: IC49.31 IC50.31 IC51.31 IC52.31
N$678: IC49.32 IC50.32 IC51.32 IC52.32
N$679: IC49.33 IC50.33 IC51.33 IC52.33
N$680: IC49.34 IC50.34 IC51.34 IC52.34
N$681: IC49.35 IC50.35 IC51.35 IC52.35
N$682: IC49.36 IC50.36 IC51.36 IC52.36
N$683: IC49.37 IC50.37 IC51.37 IC52.37
N$684: IC49.38 IC50.38 IC51.38 IC52.38
N$685: IC49.39 IC50.39 IC51.39 IC52.39
N$686: IC49.40 IC50.40 IC51.40 IC52.40
N$687: IC49.41 IC50.41 IC51.41 IC52.41
N$688: IC49.42 IC50.42 IC51.42 IC52.42
N$689: IC53.1 IC54.1 IC55.1 IC56.1
N$690: IC53.2 IC54.2 IC55.2 IC56.2
N$691: IC53.3 IC54.3 IC55.3 IC56.3
N$692: IC53.4 IC54.4 IC55.4 IC56.4
N$693: IC53.5 IC54.5 IC55.5 IC56.5
N$694: IC53.6 IC54.6 IC55.6 IC56.6
N$695: IC53.7 IC54.7 IC55.7 IC56.7
N$696: IC53.8 IC54.8 IC55.8 IC56.8
N$697: IC53.9 IC54.9 IC55.9 IC56.9
N$698: IC53.10 IC54.10 IC55.10 IC56.10
N$699: IC53.11 IC54.11 IC55.11 IC56.11
N$700: IC53.12 IC54.12 IC55.12 IC56.12
N$701: IC53.13 IC54.13 IC55.13 IC56.13
N$702: IC53.14 IC54.14 IC55.14 IC56.14
N$703: IC53.15 IC54.15 IC55.15 IC56.15
N$704: IC53.16 IC54.16 IC55.16 IC56.16
N$705: IC53.17 IC54.17 IC55.17 IC56.17
N$706: IC53.18 IC54.18 IC55.18 IC56.18
N$707: IC53.19 IC54.19 IC55.19 IC56.19
N$708: IC53.20 IC54.20 IC55.20 IC56.20
N$709: IC53.21 IC54.21 IC55.21 IC56.21
N$710: IC53.22 IC54.22 IC55.22 IC56.22
N$711: IC53.23 IC54.23 IC55.23 IC56.23
N$712: IC53.24 IC54.24 IC55.24 IC56.24
N$713: IC53.25 IC54.25 IC55.25 IC56.25
N$714: IC53.26 IC54.26 IC55.26 IC56.26
N$715: IC53.27 IC54.27 IC55.27 IC56.27
N$716: IC53.28 IC54.28 IC55.28 IC56.28
N$717: IC53.29 IC54.29 IC55.29 IC56.29
N$718: IC53.30 IC54.30 IC55.30 IC56.30
N$719: IC53.31 IC54.31 IC55.31 IC56.31
N$720: IC53.32 IC54.32 IC55.32 IC56.32
N$721: IC53.33 IC54.33 IC55.33 IC56.33
N$722: IC53.34 IC54.34 IC55.34 IC56.34
N$723: IC53.35 IC54.35 IC55.35 IC56.35
N$724: IC53.36 IC54.36 IC55.36 IC56.36
N$725: IC53.37 IC54.37 IC55.37 IC56.37
N$726: IC53.38 IC54.38 IC55.38 IC56.38
N$727: IC53.39 IC54.39 IC55.39 IC56.39
N$728: IC53.40 IC54.40 IC55.40 IC56.40
N$729: IC53.41 IC54.41 IC55.41 IC56.41
N$730: IC53.42 IC54.42 IC55.42 IC56.42
N$731: IC57.1 IC58.1 IC59.1 IC60.1
N$732: IC57.2 IC58.2 IC59.2 IC60.2
N$733: IC57.3 IC58.3 IC59.3 IC60.3
N$734: IC57.4 IC58.4 IC59.4 IC60.4
N$735: IC57.5 IC58.5 IC59.5 IC60.5
N$736: IC57.6 IC58.6 IC59.6 IC60.6
N$737: IC57.7 IC58.7 IC59.7 IC60.7
N$738: IC57.8 IC58.8 IC59.8 IC60.8
N$739: IC57.9 IC58.9 IC59.9 IC60.9
N$740: IC57.10 IC58.10 IC59.10 IC60.10
N$741: IC57.11 IC58.11 IC59.11 IC60.11
N$742: IC57.12 IC58.12 IC59.12 IC60.12
N$743: IC57.13 IC58.13 IC59.13 IC60.13
N$744: IC57.14 IC58.14 IC59.14 IC60.14
N$745: IC57.15 IC58.15 IC59.15 IC60.15
N$746: IC57.16 IC58.16 IC59.16 IC60.16
N$747: IC57.17 IC58.17 IC59.17 IC60.17
N$748: IC57.18 IC58.18 IC59.18 IC60.18
N$749: IC57.19 IC58.19 IC59.19 IC60.19
N$750: IC57.20 IC58.20 IC59.20 IC60.20
N$751: IC57.21 IC58.21 IC59.21 IC60.21
N$752: IC57.22 IC58.22 IC59.22 IC60.22
N$753: IC57.23 IC58.23 IC59.23 IC60.23
N$754: IC57.24 IC58.24 IC59.24 IC60.24
N$755: IC57.25 IC58.25 IC59.25 IC60.25
N$756: IC57.26 IC58.26 IC59.26 IC60.26
N$757: IC57.27 IC58.27 IC59.27 IC60.27
N$758: IC57.28 IC58.28 IC59.28 IC60.28
N$759: IC57.29 IC58.29 IC59.29 IC60.29
N$760: IC57.30 IC58.30 IC59.30 IC60.30
N$761: IC57.31 IC58.31 IC59.31 IC60.31
N$762: IC57.32 IC58.32 IC59.32 IC60.32
N$763: IC57.33 IC58.33 IC59.33 IC60.33
N$764: IC57.34 IC58.34 IC59.34 IC60.34
N$765: IC57.35 IC58.35 IC59.35 IC60.35
N$766: IC57.36 IC58.36 IC59.36 IC60.36
N$767: IC57.37 IC58.37 IC59.37 IC60.37
N$768: IC57.38 IC58.38 IC59.38 IC60.38
N$769: IC57.39 IC58.39 IC59.39 IC60.39
N$770: IC57.40 IC58.40 IC59.40 IC60.40
N$771: IC57.41 IC58.41 IC59.41 IC60.41
N$772: IC57.42 IC58.42 IC59.42 IC60.42
N$773: IC61.1 IC62.1 IC63.1 IC64.1
N$774: IC61.2 IC62.2 IC63.2 IC64.2
N$775: IC61.3 IC62.3 IC63.3 IC64.3
N$776: IC61.4 IC62.4 IC63.4 IC64.4
N$777: IC61.5 IC62.5 IC63.5 IC64.5
N$778: IC61.6 IC62.6 IC63.6 IC64.6
N$779: IC61.7 IC62.7 IC63.7 IC64.7
N$780: IC61.8 IC62.8 IC63.8 IC64.8
N$781: IC61.9 IC62.9 IC63.9 IC64.9
N$782: IC61.10 IC62.10 IC63.10 IC64.10
N$783: IC61.11 IC62.11 IC63.11 IC64.11
N$784: IC61.12 IC62.12 IC63.12 IC64.12
N$785: IC61.13 IC62.13 IC63.13 IC64.13
N$786: IC61.14 IC62.14 IC63.14 IC64.14
N$787: IC61.15 IC62.15 IC63.15 IC64.15
N$788: IC61.16 IC62.16 IC63.16 IC64.16
N$789: IC61.17 IC62.17 IC63.17 IC64.17
N$790: IC61.18 IC62.18 IC63.18 IC64.18
N$791: IC61.19 IC62.19 IC63.19 IC64.19
N$792: IC61.20 IC62.20 IC63.20 IC64.20
N$793: IC61.21 IC62.21 IC63.21 IC64.21
N$794: IC61.22 IC62.22 IC63.22 IC64.22
N$795: IC61.23 IC62.23 IC63.23 IC64.23
N$796: IC61.24 IC62.24 IC63.24 IC64.24
N$797: IC61.25 IC62.25 IC63.25 IC64.25
N$798: IC61.26 IC62.26 IC63.26 IC64.26
N$799: IC61.27 IC62.27 IC63.27 IC64.27
N$800: IC61.28 IC62.28 IC63.28 IC64.28
N$801: IC61.29 IC62.29 IC63.29 IC64.29
N$802: IC61.30 IC62.30 IC63.30 IC64.30
N$803: IC61.31 IC62.31 IC63.31 IC64.31
N$804: IC61.32 IC62.32 IC63.32 IC64.32
N$805: IC61.33 IC62.33 IC63.33 IC64.33
N$806: IC61.34 IC62.34 IC63.34 IC64.34
N$807: IC61.35 IC62.35 IC63.35 IC64.35
N$808: IC61.36 IC62.36 IC63.36 IC64.36
N$809: IC61.37 IC62.37 IC63.37 IC64.37
N$810: IC61.38 IC62.38 IC63.38 IC64.38
N$811: IC61.39 IC62.39 IC63.39 IC64.39
N$812: IC61.40 IC62.40 IC63.40 IC64.40
N$813: IC61.41 IC62.41 IC63.41 IC64.41
N$814: IC61.42 IC62.42 IC63.42 IC64.42
N$815: IC65.1 IC66.1 IC67.1 IC68.1
N$816: IC65.2 IC66.2 IC67.2 IC68.2
N$817: IC65.3 IC66.3 IC67.3 IC68.3
N$818: IC65.4 IC66.4 IC67.4 IC68.4
N$819: IC65.5 IC66.5 IC67.5 IC68.5
N$820: IC65.6 IC66.6 IC67.6 IC68.6
N$821: IC65.7 IC66.7 IC67.7 IC68.7
N$822: IC65.8 IC66.8 IC67.8 IC68.8
N$823: IC65.9 IC66.9 IC67.9 IC68.9
N$824: IC65.10 IC66.10 IC67.10 IC68.10
N$825: IC65.11 IC66.11 IC67.11 IC68.11
N$826: IC65.12 IC66.12 IC67.12 IC68.12
N$827: IC65.13 IC66.13 IC67.13 IC68.13
N$828: IC65.14 IC66.14 IC67.14 IC68.14
N$829: IC65.15 IC66.15 IC67.15 IC68.15
N$830: IC65.16 IC66.16 IC67.16 IC68.16
N$831: IC65.17 IC66.17 IC67.17 IC68.17
N$832: IC65.18 IC66.18 IC67.18 IC68.18
N$833: IC65.19 IC66.19 IC67.19 IC68.19
N$834: IC65.20 IC66.20 IC67.20 IC68.20
N$835: IC65.21 IC66.21 IC67.21 IC68.21
N$836: IC65.22 IC66.22 IC67.22 IC68.22
N$837: IC65.23 IC66.23 IC67.23 IC68.23
N$838: IC65.24 IC66.24 IC67.24 IC68.24
N$839: IC65.25 IC66.25 IC67.25 IC68.25
N$840: IC65.26 IC66.26 IC67.26 IC68.26
N$841: IC65.27 IC66.27 IC67.27 IC68.27
N$842: IC65.28 IC66.28 IC67.28 IC68.28
N$843: IC65.29 IC66.29 IC67.29 IC68.29
N$844: IC65.30 IC66.30 IC67.30 IC68.30
N$845: IC65.31 IC66.31 IC67.31 IC68.31
N$846: IC65.32 IC66.32 IC67.32 IC68.32
N$847: IC65.33 IC66.33 IC67.33 IC68.33
N$848: IC65.34 IC66.34 IC67.34 IC68.34
N$849: IC65.35 IC66.35 IC67.35 IC68.35
N$850: IC65.36 IC66.36 IC67.36 IC68.36
N$851: IC65.37 IC66.37 IC67.37 IC68.37
N$852: IC65.38 IC66.38 IC67.38 IC68.38
N$853: IC65.39 IC66.39 IC67.39 IC68.39
N$854: IC65.40 IC66.40 IC67.40 IC68.40
N$855: IC65.41 IC66.41 IC67.41 IC68.41
N$856: IC65.42 IC66.42 IC67.42 IC68.42
N$857: IC69.1 IC70.1 IC71.1 IC72.1
N$858: IC69.2 IC70.2 IC71.2 IC72.2
N$859: IC69.3 IC70.3 IC71.3 IC72.3
N$860: IC69.4 IC70.4 IC71.4 IC72.4
N$861: IC69.5 IC70.5 IC71.5 IC72.5
N$862: IC69.6 IC70.6 IC71.6 IC72.6
N$863: IC69.7 IC70.7 IC71.7 IC72.7
N$864: IC69.8 IC70.8 IC71.8 IC72.8
N$865: IC69.9 IC70.9 IC71.9 IC72.9
N$866: IC69.10 IC70.10 IC71.10 IC72.10
N$867: IC69.11 IC70.11 IC71.11 IC72.11
N$868: IC69.12 IC70.12 IC71.12 IC72.12
N$869: IC69.13 IC70.13 IC71.13 IC72.13
N$870: IC69.14 IC70.14 IC71.14 IC72.14
N$871: IC69.15 IC70.15 IC71.15 IC72.15
N$872: IC69.16 IC70.16 IC71.16 IC72.16
N$873: IC69.17 IC70.17 IC71.17 IC72.17
N$874: IC69.18 IC70.18 IC71.18 IC72.18
N$875: IC69.19 IC70.19 IC71.19 IC72.19
N$876: IC69.20 IC70.20 IC71.20 IC72.20
N$877: IC69.21 IC70.21 IC71.21 IC72.21
N$878: IC69.22 IC70.22 IC71.22 IC72.22
N$879: IC69.23 IC70.23 IC71.23 IC72.23
N$880: IC69.24 IC70.24 IC71.24 IC72.24
N$881: IC69.25 IC70.25 IC71.25 IC72.25
N$882: IC69.26 IC70.26 IC71.26 IC72.26
N$883: IC69.27 IC70.27 IC71.27 IC72.27
N$884: IC69.28 IC70.28 IC71.28 IC72.28
N$885: IC69.29 IC70.29 IC71.29 IC72.29
N$886: IC69.30 IC70.30 IC71.30 IC72.30
N$887: IC69.31 IC70.31 IC71.31 IC72.31
N$888: IC69.32 IC70.32 IC71.32 IC72.32
N$889: IC69.33 IC70.33 IC71.33 IC72.33
N$890: IC69.34 IC70.34 IC71.34 IC72.34
N$891: IC69.35 IC70.35 IC71.35 IC72.35
N$892: IC69.36 IC70.36 IC71.36 IC72.36
N$893: IC69.37 IC70.37 IC71.37 IC72.37
N$894: IC69.38 IC70.38 IC71.38 IC72.38
N$895: IC69.39 IC70.39 IC71.39 IC72.39
N$896: IC69.40 IC70.40 IC71.40 IC72.40
N$897: IC69.41 IC70.41 IC71.41 IC72.41
N$898: IC69.42 IC70.42 IC71.42 IC72.42
N$899: IC73.1 IC74.1 IC75.1 IC76.1
N$900: IC73.2 IC74.2 IC75.2 IC76.2
N$901: IC73.3 IC74.3 IC75.3 IC76.3
N$902: IC73.4 IC74.4 IC75.4 IC76.4
N$903: IC73.5 IC74.5 IC75.5 IC76.5
N$904: IC73.6 IC74.6 IC75.6 IC76.6
N$905: IC73.7 IC74.7 IC75.7 IC76.7
N$906: IC73.8 IC74.8 IC75.8 IC76.8
N$907: IC73.9 IC74.9 IC75.9 IC76.9
N$908: IC73.10 IC74.10 IC75.10 IC76.10
N$909: IC73.11 IC74.11 IC75.11 IC76.11
N$910: IC73.12 IC74.12 IC75.12 IC76.12
N$911: IC73.13 IC74.13 IC75.13 IC76.13
N$912: IC73.14 IC74.14 IC75.14 IC76.14
N$913: IC73.15 IC74.15 IC75.15 IC76.15
N$914: IC73.16 IC74.16 IC75.16 IC76.16
N$915: IC73.17 IC74.17 IC75.17 IC76.17
N$916: IC73.18 IC74.18 IC75.18 IC76.18
N$917: IC73.19 IC74.19 IC75.19 IC76.19
N$918: IC73.20 IC74.20 IC75.20 IC76.20
N$919: IC73.21 IC74.21 IC75.21 IC76.21
N$920: IC73.22 IC74.22 IC75.22 IC76.22
N$921: IC73.23 IC74.23 IC75.23 IC76.23
N$922: IC73.24 IC74.24 IC75.24 IC76.24
N$923: IC73.25 IC74.25 IC75.25 IC76.25
N$924: IC73.26 IC74.26 IC75.26 IC76.26
N$925: IC73.27 IC74.27 IC75.27 IC76.27
N$926: IC73.28 IC74.28 IC75.28 IC76.28
N$927: IC73.29 IC74.29 IC75.29 IC76.29
N$928: IC73.30 IC74.30 IC75.30 IC76.30
N$929: IC73.31 IC74.31 IC75.31 IC76.31
N$930: IC73.32 IC74.32 IC75.32 IC76.32
N$931: IC73.33 IC74.33 IC75.33 IC76.33
N$932: IC73.34 IC74.34 IC75.34 IC76.34
N$933: IC73.35 IC74.35 IC75.35 IC76.35
N$934: IC73.36 IC74.36 IC75.36 IC76.36
N$935: IC73.37 IC74.37 IC75.37 IC76.37
N$936: IC73.38 IC74.38 IC75.38 IC76.38
N$937: IC73.39 IC74.39 IC75.39 IC76.39
N$938: IC73.40 IC74.40 IC75.40 IC76.40
N$939: IC73.41 IC74.41 IC75.41 IC76.41
N$940: IC73.42 IC74.42 IC75.42 IC76.42
N$941: IC77.1 IC78.1 IC79.1 IC80.1
N$942: IC77.2 IC78.2 IC79.2 IC80.2
N$943: IC77.3 IC78.3 IC79.3 IC80.3
N$944: IC77.4 IC78.4 IC79.4 IC80.4
N$945: IC77.5 IC78.5 IC79.5 IC80.5
N$946: IC77.6 IC78.6 IC79.6 IC80.6
N$947: IC77.7 IC78.7 IC79.7 IC80.7
N$948: IC77.8 IC78.8 IC79.8 IC80.8
N$949: IC77.9 IC78.9 IC79.9 IC80.9
N$950: IC77.10 IC78.10 IC79.10 IC80.10
N$951: IC77.11 IC78.11 IC79.11 IC80.11
N$952: IC77.12 IC78.12 IC79.12 IC80.12
N$953: IC77.13 IC78.13 IC79.13 IC80.13
N$954: IC77.14 IC78.14 IC79.14 IC80.14
N$955: IC77.15 IC78.15 IC79.15 IC80.15
N$956: IC77.16 IC78.16 IC79.16 IC80.16
N$957: IC77.17 IC78.17 IC79.17 IC80.17
N$958: IC77.18 IC78.18 IC79.18 IC80.18
N$959: IC77.19 IC78.19 IC79.19 IC80.19
N$960: IC77.20 IC78.20 IC79.20 IC80.20
N$961: IC77.21 IC78.21 IC79.21 IC80.21
N$962: IC77.22 IC78.22 IC79.22 IC80.22
N$963: IC77.23 IC78.23 IC79.23 IC80.23
N$964: IC77.24 IC78.24 IC79.24 IC80.24
N$965: IC77.25 IC78.25 IC79.25 IC80.25
N$966: IC77.26 IC78.26 IC79.26 IC80.26
N$967: IC77.27 IC78.27 IC79.27 IC80.27
N$968: IC77.28 IC78.28 IC79.28 IC80.28
N$969: IC77.29 IC78.29 IC79.29 IC80.29
N$970: IC77.30 IC78.30 IC79.30 IC80.30
N$971: IC77.31 IC78.31 IC79.31 IC80.31
N$972: IC77.32 IC78.32 IC79.32 IC80.32
N$973: IC77.33 IC78.33 IC79.33 IC80.33
N$974: IC77.34 IC78.34 IC79.34 IC80.34
N$975: IC77.35 IC78.35 IC79.35 IC80.35
N$976: IC77.36 IC78.36 IC79.36 IC80.36
N$977: IC77.37 IC78.37 IC79.37 IC80.37
N$978: IC77.38 IC78.38 IC79.38 IC80.38
N$979: IC77.39 IC78.39 IC79.39 IC80.39
N$980: IC77.40 IC78.40 IC79.40 IC80.40
N$981: IC77.41 IC78.41 IC79.41 IC80.41
N$982: IC77.42 IC78.42 IC79.42 IC80.42
N$983: IC81.1 IC82.1 IC83.1 IC84.1
N$984: IC81.2 IC82.2 IC83.2 IC84.2
N$985: IC81.3 IC82.3 IC83.3 IC84.3
N$986: IC81.4 IC82.4 IC83.4 IC84.4
N$987: IC81.5 IC82.5 IC83.5 IC84.5
N$988: IC81.6 IC82.6 IC83.6 IC84.6
N$989: IC81.7 IC82.7 IC83.7 IC84.7
N$990: IC81.8 IC82.8 IC83.8 IC84.8
N$991: IC81.9 IC82.9 IC83.9 IC84.9
N$992: IC81.10 IC82.10 IC83.10 IC84.10
N$993: IC81.11 IC82.11 IC83.11 IC84.11
N$994: IC81.12 IC82.12 IC83.12 IC84.12
N$995: IC81.13 IC82.13 IC83.13 IC84.13
N$996: IC81.14 IC82.14 IC83.14 IC84.14
N$997: IC81.15 IC82.15 IC83.15 IC84.15
N$998: IC81.16 IC82.16 IC83.16 IC84.16
N$999: IC81.17 IC82.17 IC83.17 IC84.17
N$1000: IC81.18 IC82.18 IC83.18 IC84.18
N$1001: IC81.19 IC82.19 IC83.19 IC84.19
N$1002: IC81.20 IC82.20 IC83.20 IC84.20
N$1003: IC81.21 IC82.21 IC83.21 IC84.21
N$1004: IC81.22 IC82.22 IC83.22 IC84.22
N$1005: IC81.23 IC82.23 IC83.23 IC84.23
N$1006: IC81.24 IC82.24 IC83.24 IC84.24
N$1007: IC81.25 IC82.25 IC83.25 IC84.25
N$1008: IC81.26 IC82.26 IC83.26 IC84.26
N$1009: IC81.27 IC82.27 IC83.27 IC84.27
N$1010: IC81.28 IC82.28 IC83.28 IC84.28
N$1011: IC81.29 IC82.29 IC83.29 IC84.29
N$1012: IC81.30 IC82.30 IC83.30 IC84.30
N$1013: IC81.31 IC82.31 IC83.31 IC84.31
N$1014: IC81.32 IC82.32 IC83.32 IC84.32
N$1015: IC81.33 IC82.33 IC83.33 IC84.33
N$1016: IC81.34 IC82.34 IC83.34 IC84.34
N$1017: IC81.35 IC82.35 IC83.35 IC84.35
N$1018: IC81.36 IC82.36 IC83.36 IC84.36
N$1019: IC81.37 IC82.37 IC83.37 IC84.37
N$1020: IC81.38 IC82.38 IC83.38 IC84.38
N$1021: IC81.39 IC82.39 IC83.39 IC84.39
N$1022: IC81.40 IC82.40 IC83.40 IC84.40
N$1023: IC81.41 IC82.41 IC83.41 IC84.41
N$1024: IC81.42 IC82.42 IC83.42 IC84.42
N$1025: IC85.1 IC86.1 IC87.1 IC88.1
N$1026: IC85.2 IC86.2 IC87.2 IC88.2
N$1027: IC85.3 IC86.3 IC87.3 IC88.3
N$1028: IC85.4 IC86.4 IC87.4 IC88.4
N$1029: IC85.5 IC86.5 IC87.5 IC88.5
N$1030: IC85.6 IC86.6 IC87.6 IC88.6
N$1031: IC85.7 IC86.7 IC87.7 IC88.7
N$1032: IC85.8 IC86.8 IC87.8 IC88.8
N$1033: IC85.9 IC86.9 IC87.9 IC88.9
N$1034: IC85.10 IC86.10 IC87.10 IC88.10
N$1035: IC85.11 IC86.11 IC87.11 IC88.11
N$1036: IC85.12 IC86.12 IC87.12 IC88.12
N$1037: IC85.13 IC86.13 IC87.13 IC88.13
N$1038: IC85.14 IC86.14 IC87.14 IC88.14
N$1039: IC85.15 IC86.15 IC87.15 IC88.15
N$1040: IC85.16 IC86.16 IC87.16 IC88.16
N$1041: IC85.17 IC86.17 IC87.17 IC88.17
N$1042: IC85.18 IC86.18 IC87.18 IC88.18
N$1043: IC85.19 IC86.19 IC87.19 IC88.19
N$1044: IC85.20 IC86.20 IC87.20 IC88.20
N$1045: IC85.21 IC86.21 IC87.21 IC88.21
N$1046: IC85.22 IC86.22 IC87.22 IC88.22
N$1047: IC85.23 IC86.23 IC87.23 IC88.23
N$1048: IC85.24 IC86.24 IC87.24 IC88.24
N$1049: IC85.25 IC86.25 IC87.25 IC88.25
N$1050: IC85.26 IC86.26 IC87.26 IC88.26
N$1051: IC85.27 IC86.27 IC87.27 IC88.27
N$1052: IC85.28 IC86.28 IC87.28 IC88.28
N$1053: IC85.29 IC86.29 IC87.29 IC88.29
N$1054: IC85.30 IC86.30 IC87.30 IC88.30
N$1055: IC85.31 IC86.31 IC87.31 IC88.31
N$1056: IC85.32 IC86.32 IC87.32 IC88.32
N$1057: IC85.33 IC86.33 IC87.33 IC88.33
N$1058: IC85.34 IC86.34 IC87.34 IC88.34
N$1059: IC85.35 IC86.35 IC87.35 IC88.35
N$1060: IC85.36 IC86.36 IC87.36 IC88.36
N$1061: IC85.37 IC86.37 IC87.37 IC88.37
N$1062: IC85.38 IC86.38 IC87.38 IC88.38
N$1063: IC85.39 IC86.39 IC87.39 IC88.39
N$1064: IC85.40 IC86.40 IC87.40 IC88.40
N$1065: IC85.41 IC86.41 IC87.41 IC88.41
N$1066: IC85.42 IC86.42 IC87.42 IC88.42
N$1067: IC89.1 IC90.1 IC91.1 IC92.1
N$1068: IC89.2 IC90.2 IC91.2 IC92.2
N$1069: IC89.3 IC90.3 IC91.3 IC92.3
N$1070: IC89.4 IC90.4 IC91.4 IC92.4
N$1071: IC89.5 IC90.5 IC91.5 IC92.5
N$1072: IC89.6 IC90.6 IC91.6 IC92.6
N$1073: IC89.7 IC90.7 IC91.7 IC92.7
N$1074: IC89.8 IC90.8 IC91.8 IC92.8
N$1075: IC89.9 IC90.9 IC91.9 IC92.9
N$1076: IC89.10 IC90.10 IC91.10 IC92.10
N$1077: IC89.11 IC90.11 IC91.11 IC92.11
N$1078: IC89.12 IC90.12 IC91.12 IC92.12
N$1079: IC89.13 IC90.13 IC91.13 IC92.13
N$1080: IC89.14 IC90.14 IC91.14 IC92.14
N$1081: IC89.15 IC90.15 IC91.15 IC92.15
N$1082: IC89.16 IC90.16 IC91.16 IC92.16
N$1083: IC89.17 IC90.17 IC91.17 IC92.17
N$1084: IC89.18 IC90.18 IC91.18 IC92.18
N$1085: IC89.19 IC90.19 IC91.19 IC92.19
N$1086: IC89.20 IC90.20 IC91.20 IC92.20
N$1087: IC89.21 IC90.21 IC91.21 IC92.21
N$1088: IC89.22 IC90.22 IC91.22 IC92.22
N$1089: IC89.23 IC90.23 IC91.23 IC92.23
N$1090: IC89.24 IC90.24 IC91.24 IC92.24
N$1091: IC89.25 IC90.25 IC91.25 IC92.25
N$1092: IC89.26 IC90.26 IC91.26 IC92.26
N$1093: IC89.27 IC90.27 IC91.27 IC92.27
N$1094: IC89.28 IC90.28 IC91.28 IC92.28
N$1095: IC89.29 IC90.29 IC91.29 IC92.29
N$1096: IC89.30 IC90.30 IC91.30 IC92.30
N$1097: IC89.31 IC90.31 IC91.31 IC92.31
N$1098: IC89.32 IC90.32 IC91.32 IC92.32
N$1151: SV1.A U$2.1
N$1152: SV1.C U$2.2
N$1153: SV1.E U$2.3
N$1154: SV1.H U$2.4
N$1155: SV1.K U$2.5
N$1156: SV1.M U$2.6
N$1157: SV1.P U$2.7
N$1158: SV1.S U$2.8
N$1159: SV1.U U$2.9
N$1160: SV1.W U$2.10
N$1161: SV1.Y U$2.11
N$1162: SV1.AA U$2.12
N$1163: SV1.CC U$2.13
N$1164: SV1.EE U$2.14
N$1165: SV1.HH U$2.15
N$1166: SV1.KK U$2.16
N$1167: SV1.MM U$2.17
N$1168: SV1.PP U$2.18
N$1169: SV1.SS U$2.19
N$1170: SV1.UU U$2.20
N$1171: SV1.B U$4.1
N$1172: SV1.D U$4.2
N$1173: SV1.F U$4.3
N$1174: SV1.J U$4.4
N$1175: SV1.L U$4.5
N$1176: SV1.N U$4.6
N$1177: SV1.R U$4.7
N$1178: SV1.T U$4.8
N$1179: SV1.V U$4.9
N$1180: SV1.X U$4.10
N$1181: SV1.Z U$4.11
N$1182: SV1.BB U$4.12
N$1183: SV1.DD U$4.13
N$1184: SV1.FF U$4.14
N$1185: SV1.JJ U$4.15
N$1186: SV1.LL U$4.16
N$1187: SV1.NN U$4.17
N$1188: SV1.RR U$4.18
N$1189: SV1.TT U$4.19
N$1190: SV1.VV U$4.20
VCC [supply]: U$1.AA2 U$5.1

## Library data of the parts
IC1-IC88 = ic-package:DIL42: Dual In Line
IC89-IC92 = ic-package:DIL32: Dual In Line
SV1 = dec-con:DEC40PIN: PIN HEADER
U$1 = dec-con:QUAD: Quad-Height DEC board
U$2 U$4 = dec-con:MA20-1
U$3 U$5-U$7 U$9-U$12 = dec-con:MA18-1
U$8 = dec-con:OUTLINE-*: Board outlines for DEC boards.

## Net classes
1 supply: width 0.508 mm